# Altium schematic sheet 3763.SchDoc
size A4
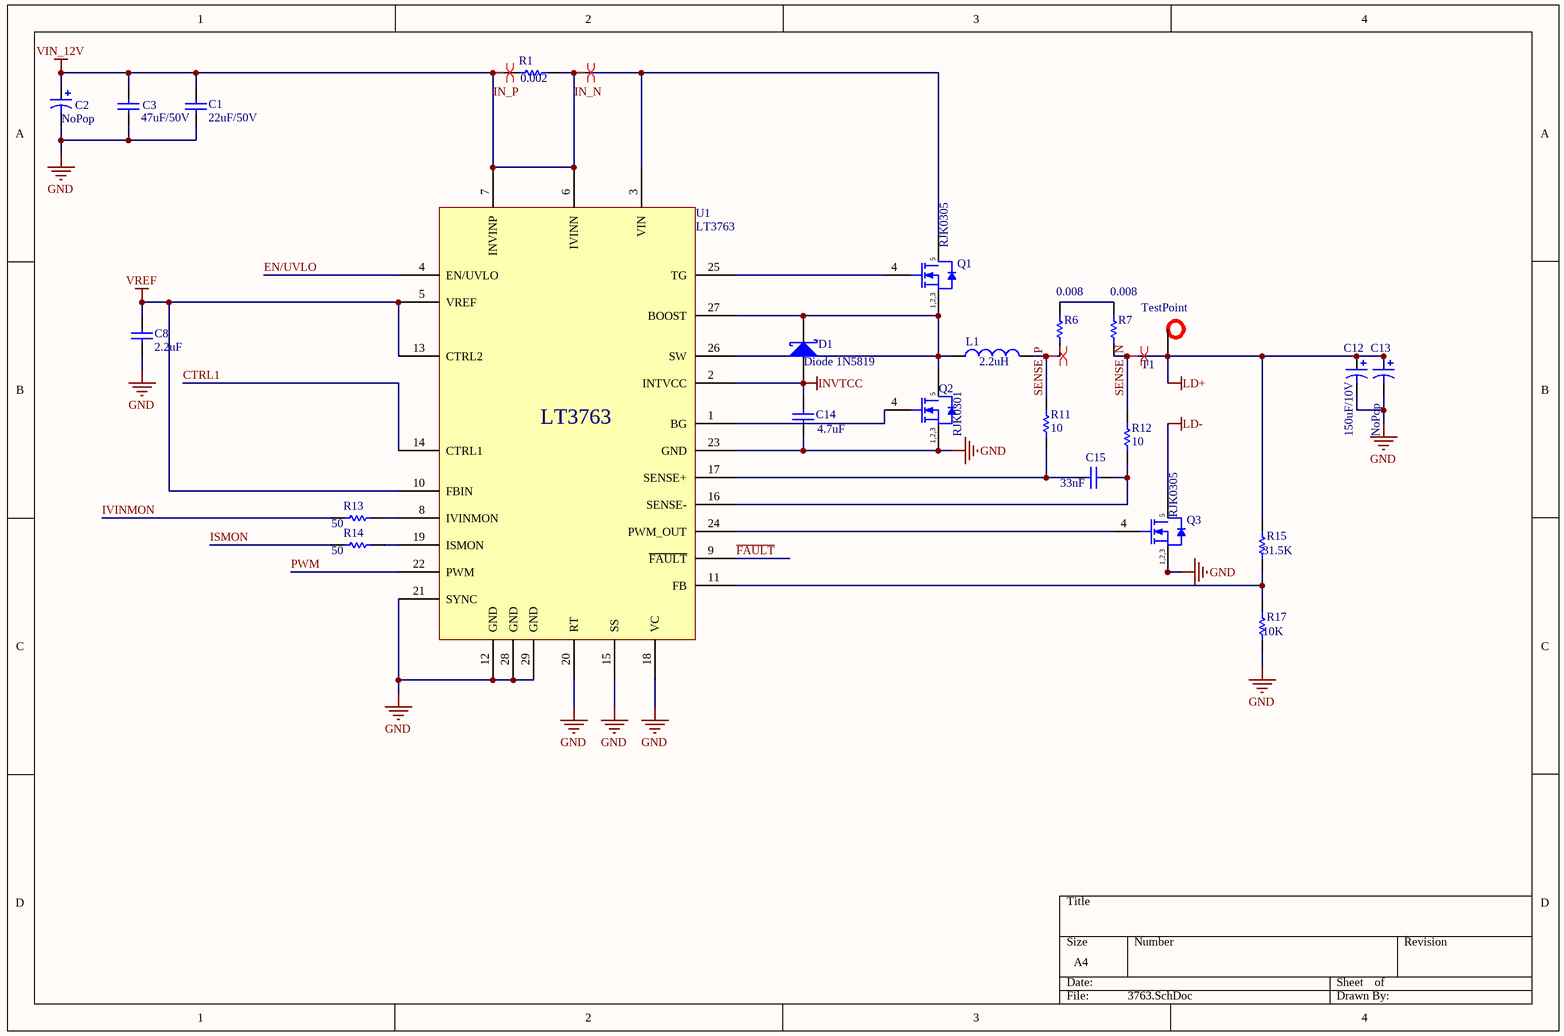
[diagram p0: 3763.SchDoc]

## Parts
C1  22uF/50V  [1206[3216] - NP]
C2  NoPop  [SMC_Altium Capacity 8*10]
C3  47uF/50V  [1206[3216] - NP]
C8  2.2uF  [1608[0603]]
C12  150uF/10V  [7343]
C13  NoPop  [SMC_Altium Capacity 8*10]
C14  4.7uF  [1608[0603]]
C15  33nF  [1608[0603]]
D1  Diode 1N5819  [SMA]
L1  value 2.2uH  [IHLP4040]  (hidden comment: Inductor,2.2uH)
Q1  RJK0305  [LFPAK]
Q2  RJK0301  [LFPAK]
Q3  RJK0305  [LFPAK]
R1  0.002  [2512[6432]]
R6  0.008  [2512[6432]]
R7  0.008  [2512[6432]]
R11  10  [1608[0603]]
R12  10  [1608[0603]]
R13  50  [1608[0603]]
R14  50  [1608[0603]]
R15  31.5K  [1608[0603]]
R17  10K  [1608[0603]]
T1  Test Point  [TestPoint]  (value not drawn)
U1  LT3763  [TSOP65P640X120_HS-29N]

## Nets
GND: C1.1 C2.2 C3.1 C8.1 C12.2 C13.2 C14.1 Q2.1(SOURCE) Q2.2(SOURCE) Q2.3(SOURCE) Q3.1(SOURCE) Q3.2(SOURCE) Q3.3(SOURCE) R17.2 U1.12(GND) U1.15(SS) U1.18(VC) U1.20(RT) U1.21(SYNC) U1.23(GND) U1.28(GND) U1.29(GND)
IN_N: C1.2 C2.1 C3.2 Q1.5(DRAIN) R1.1 R1.2 U1.3(VIN) U1.6(IVINN) U1.7(INVINP)  [also labelled IN_P, VIN_12V]
INVTCC: C14.2 D1.1(A) U1.2(INTVCC)
LD-: Q3.5(DRAIN)
SENSE_N: C12.1 C13.1 R7.1 R12.2 R15.1 T1.1(TP)  [also labelled LD+]
VREF: C8.2 U1.5(VREF) U1.10(FBIN) U1.13(CTRL2)
CTRL1: U1.14(CTRL1)
EN/UVLO: U1.4(EN/UVLO)
~{FAULT}: U1.9(~{FAULT})
ISMON: R14.2
IVINMON: R13.2
PWM: U1.22(PWM)
SENSE_P: L1.2 R6.1 R11.2
NetC15_1: C15.1 R11.1 U1.17(SENSE+)
NetC15_2: C15.2 R12.1 U1.16(SENSE-)
NetD1_2: D1.2(K) L1.1 Q1.1(SOURCE) Q1.2(SOURCE) Q1.3(SOURCE) Q2.5(DRAIN) U1.26(SW) U1.27(BOOST)
NetQ1_4: Q1.4(GATE) U1.25(TG)
NetQ2_4: Q2.4(GATE) U1.1(BG)
NetQ3_4: Q3.4(GATE) U1.24(PWM_OUT)
NetR6_2: R6.2 R7.2
NetR13_1: R13.1 U1.8(IVINMON)
NetR14_1: R14.1 U1.19(ISMON)
NetR15_2: R15.2 R17.1 U1.11(FB)

## Layout directives
differential pair: IN_N, SENSE_N, SENSE_P

## Notes on the sheet
- (in symbol PWR_RJK030) 1,2,3
- (in symbol TP) TestPoint

## Library data of the parts
C1 = Cap: Capacitor; Value: 22uF; Published: 8-Jun-2000; LatestRevisionDate: 17-Jul-2002; LatestRevisionNote: Re-released for DXP Platform.; PackageReference: RAD-0.3; Publisher: Altium Limited; PackageDescription: Radial Cap, Thru-Hole; 2 Leads; 0.3 in Pin Spacing
C2 C13 = Cap Pol1: Altium Electrolytic Cap; Value: 100uF/50V; Published: 8-Jun-2000; LatestRevisionDate: 17-Jul-2002; LatestRevisionNote: Re-released for DXP Platform.; PackageReference: RB7.6-15; Publisher: Altium Limited; PackageDescription: Polarized Capacitor (Radial); 2 Leads
C3 = Cap: Capacitor; Value: 47uF; Published: 8-Jun-2000; LatestRevisionDate: 17-Jul-2002; LatestRevisionNote: Re-released for DXP Platform.; PackageReference: RAD-0.3; Publisher: Altium Limited; PackageDescription: Radial Cap, Thru-Hole; 2 Leads; 0.3 in Pin Spacing
C8 C14 C15 = Cap: Capacitor; Published: 8-Jun-2000; LatestRevisionDate: 17-Jul-2002; LatestRevisionNote: Re-released for DXP Platform.; PackageReference: RAD-0.3; Publisher: Altium Limited; PackageDescription: Radial Cap, Thru-Hole; 2 Leads; 0.3 in Pin Spacing
  C8: Value: 2.2uF
  C14: Value: 4.7uF
  C15: Value: 33nF
C12 = Cap Pol1: Tantum Cap; Value: 150uF; Published: 8-Jun-2000; LatestRevisionDate: 17-Jul-2002; LatestRevisionNote: Re-released for DXP Platform.; PackageReference: RB7.6-15; Publisher: Altium Limited; PackageDescription: Polarized Capacitor (Radial); 2 Leads
D1 = D Schottky: Schottky Diode; Published: 8-Jun-2000; LatestRevisionDate: 17-Jul-2002; LatestRevisionNote: Re-released for DXP Platform.; PackageReference: SMB; Publisher: Altium Limited; PackageDescription: DO-214-AA/SMB; 2 C-Bend Leads; Body 5.3 x 3.6 mm, inc. leads (LxW); Code_JEDEC: DO-214-AA
L1 = Inductor: Code_IEC: 1005; Published: 8-Jun-2000; LatestRevisionDate: 29-May-2009; LatestRevisionNote: IPC-7351 Footprint Added.; PackageReference: 0402-A; Publisher: Altium Limited; PackageDescription: Chip Inductor; Code_JEITA: 0402
Q1-Q3 = PWR_RJK030: N_MOSFET; Manufacturer: Infineon; PartNumber: BSC160N10NS3 G; Green: TRUE; ID (max): 42 A; IDpuls (max): 168 A; Packing: Reel; Polarity: N; Ptot (max): 60 W; QG: 19 nC; RDS (on) (max): 16 mOhm; Rth: 2.1 K/W; RthJA (max): 50 K/W; VDS (max): 100 V; VGS(th) (max): 3.5 V; VGS(th) (min): 2 V; DatasheetVersion: Rev. 2.4; PackageReference: PG-TDSON-8-1; PackageDescription: 8-Pin Plastic (Green) Thin Dual Small Outline Non-Leaded Package, 5.15 x 5.9 mm Body, 1.27 mm Pitch; Supplier 1: Digi-Key; Supplier Part Number 1: BSC160N10NS3 GINTR-ND; Supplier 2: Digi-Key; Supplier Part Number 2: BSC160N10NS3 GINCT-ND; Supplier 3: Digi-Key; Supplier Part Number 3: BSC160N10NS3 GINDKR-ND; Supplier 4: Mouser; Supplier Part Number 4: 726-BSC160N10NS3G; Halogen-free: TRUE; RthJC (max): 2.1 K/W; Mounting Technology: Surface Mount; ComponentLink1Description: Manufacturer URL; ComponentLink1URL: http://www.infineon.com/; ComponentLink2Description: Datasheet; ComponentLink2URL: http://www.infineon.com/dgdl/BSC160N10NS3+Rev2.4.pdf?folderId=db3a304313b8b5a60113cee8763b02d7&fileId=db3a30432239cccd01226040189a7f47; ComponentLink3Description: Package Specification; ComponentLink3URL: http://www.infineon.com/cms/packages/SMD_-_Surface_Mounted_Devices/P-PG-TDSON/P-PG-TDSON-08-01x_2x_3.html?__locale=en
R1 = Res1: Resistor; Value: 2m; Published: 8-Jun-2000; LatestRevisionDate: 17-Jul-2002; LatestRevisionNote: Re-released for DXP Platform.; PackageReference: AXIAL-0.3; Publisher: Altium Limited; PackageDescription: Axial Device, Thru-Hole; 2 Leads; 0.3 in Pin Spacing
R6 R7 = Res1: Resistor; Value: 8m; Published: 8-Jun-2000; LatestRevisionDate: 17-Jul-2002; LatestRevisionNote: Re-released for DXP Platform.; PackageReference: AXIAL-0.3; Publisher: Altium Limited; PackageDescription: Axial Device, Thru-Hole; 2 Leads; 0.3 in Pin Spacing
R11-R15 R17 = Res1: Resistor; Published: 8-Jun-2000; LatestRevisionDate: 17-Jul-2002; LatestRevisionNote: Re-released for DXP Platform.; PackageReference: AXIAL-0.3; Publisher: Altium Limited; PackageDescription: Axial Device, Thru-Hole; 2 Leads; 0.3 in Pin Spacing
  R11 R12: Value: 10
  R13 R14: Value: 50
  R15: Value: 31.5K
  R17: Value: 10K
T1 = TP
U1 = PWR_LT3763: 60V High Current   Step-Down LED Driver Controller